# EAGLE design LocIT (EAGLE 9.6.2)
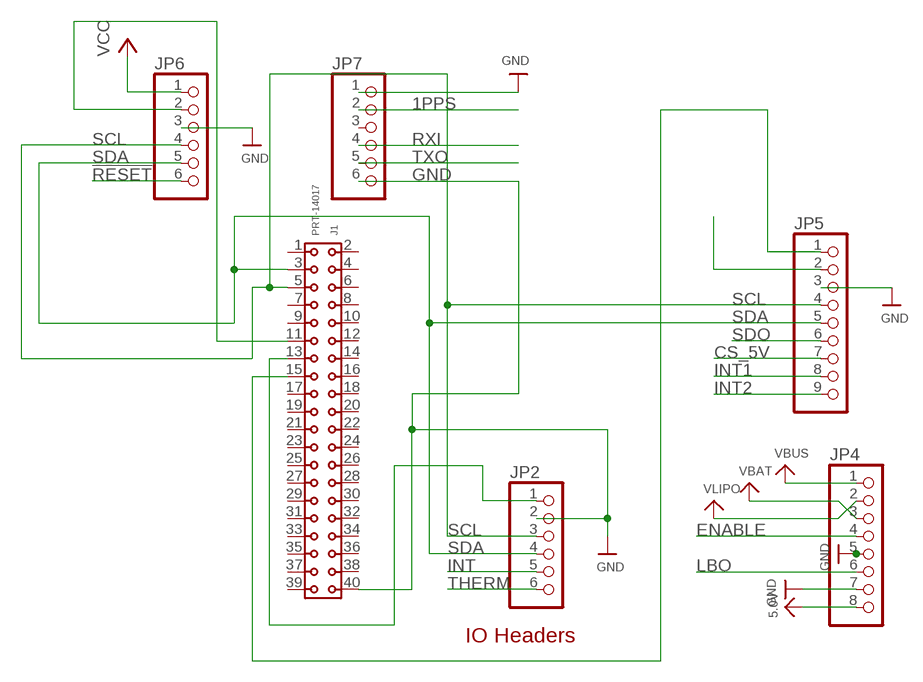
[diagram p0: schematic, sheet 1]

## Parts
J1  PRT-14017  [61304021821]
JP2  HEADER-1X670MIL  [1X06_ROUND_70]
JP4  HEADER-1X8ROUND  [1X08_ROUND]
JP5  HEADER-1X970MIL  [1X09_ROUND_70]
JP6  HEADER-1X670MIL  [1X06_ROUND_70]
JP7  HEADER-1X670MIL  [1X06_ROUND_70]

## Nets
1PPS: JP7.2
3.3V_GYRO [lowpower]: JP5.2
5.0V: JP4.8
!RESET: JP6.6
CS_5V: JP5.7
ENABLE: JP4.4
GND [highpower]: J1.40 JP2.2 JP4.5 JP4.7 JP5.3 JP6.3 JP7.1 JP7.6
INT: JP2.5
INT1: JP5.8
INT2: JP5.9
LBO: JP4.6
N$1 [lowpower]: J1.11 JP6.2
RXI: JP7.4
SCL: J1.5 JP2.3 JP5.4 JP6.4
SDA: J1.3 JP2.4 JP5.5 JP6.5
SDO: JP5.6
THERM: JP2.6
TXO: JP7.5
VBAT: JP4.3
VBUS: JP4.1
VCC [highpower]: JP6.1
VCC1 [lowpower]: J1.13 JP2.1
VCC_GYRO [highpower]: J1.15 JP5.1
VLIPO: JP4.2
Unconnected: J1.1 J1.2 J1.4 J1.6 J1.7 J1.8 J1.9 J1.10 J1.12 J1.14 J1.16 J1.17 J1.18 J1.19 J1.20 J1.21 J1.22 J1.23 J1.24 J1.25 J1.26 J1.27 J1.28 J1.29 J1.30 J1.31 J1.32 J1.33 J1.34 J1.35 J1.36 J1.37 J1.38 J1.39 JP7.3

## Notes on the sheet
- IO Headers

## Library data of the parts
J1 = PRT-14017:PRT-14017: WR-PHD 2.54 mm Dual Socket Header ARTICLE PROPERTIES: Pins:4;​ 6;​ 8;​ 10;​ 12;​ 14;​ 16;​ 18;​ 20;​ 22;​ 24;​ 26;​ 28;​ 30;​ 32;​ 34;​ 36;​ 40;​ 44;​ 64;​ 72 KIND PROPERTIES: Pitch：2.54 mm Quality Class:3 as per CECC 75 301-802 Rows：Dual Gender：Socket Header Type：Straight MATERIAL PROPERTIES: Insulator Material :PBT Insulator Flammability Rating:UL94 V-0 Contact Material:Copper Alloy Contact Plating:Gold Contact Type:Stamped GENERAL INFORMATION Operating Temperature:-40 up to +125 °C Compliance:Lead free / RoHS ELECTRICAL PROPERTIES: Rated Current:3 A IR 1:3 A Withstanding Voltage:500 V (AC) Contact Resistance:20 mΩ RISO:1000 MΩ CERTIFICATION UL Approval:E323964 PACKAGING PROPERTIES Packaging:Tray <https://katalog.we-online.com/media/images/v2/o57948v209%20Family_Dual_Socket_Header_WR-PHD_6130xx21821.jpg> Details see: https://katalog.we-online.com/en/em/PHD_2_54_DUAL_SOCKET_HEADER_6130XX21821 Updated by Yingchun,Shan 2019-10-21 2019 (C) Würth Elektronik Check availability <https://pricing.snapeda.com/parts/PRT-14017/SparkFun%20Electronics/view-part?ref=eda>; AVAILABILITY: In Stock; CHECK_PRICES: https://www.snapeda.com/parts/PRT-14017/SparkFun+Electronics/view-part/?ref=eda; DESCRIPTION: RASPBERRY PI GPIO TALL HEADER; MF: SparkFun Electronics; MP: PRT-14017; PACKAGE: None; PRICE: None; SNAPEDA_LINK: https://www.snapeda.com/parts/PRT-14017/SparkFun+Electronics/view-part/?ref=snap
JP2 JP6 JP7 = microbuilder:HEADER-1X6: PIN HEADER
JP4 = microbuilder:HEADER-1X8: PIN HEADER
JP5 = microbuilder:HEADER-1X9: PIN HEADER

## Net classes
1 highpower: width 0.406 mm, drill 0.483 mm
2 lowpower: width 0.305 mm, drill 0.483 mm

## Board
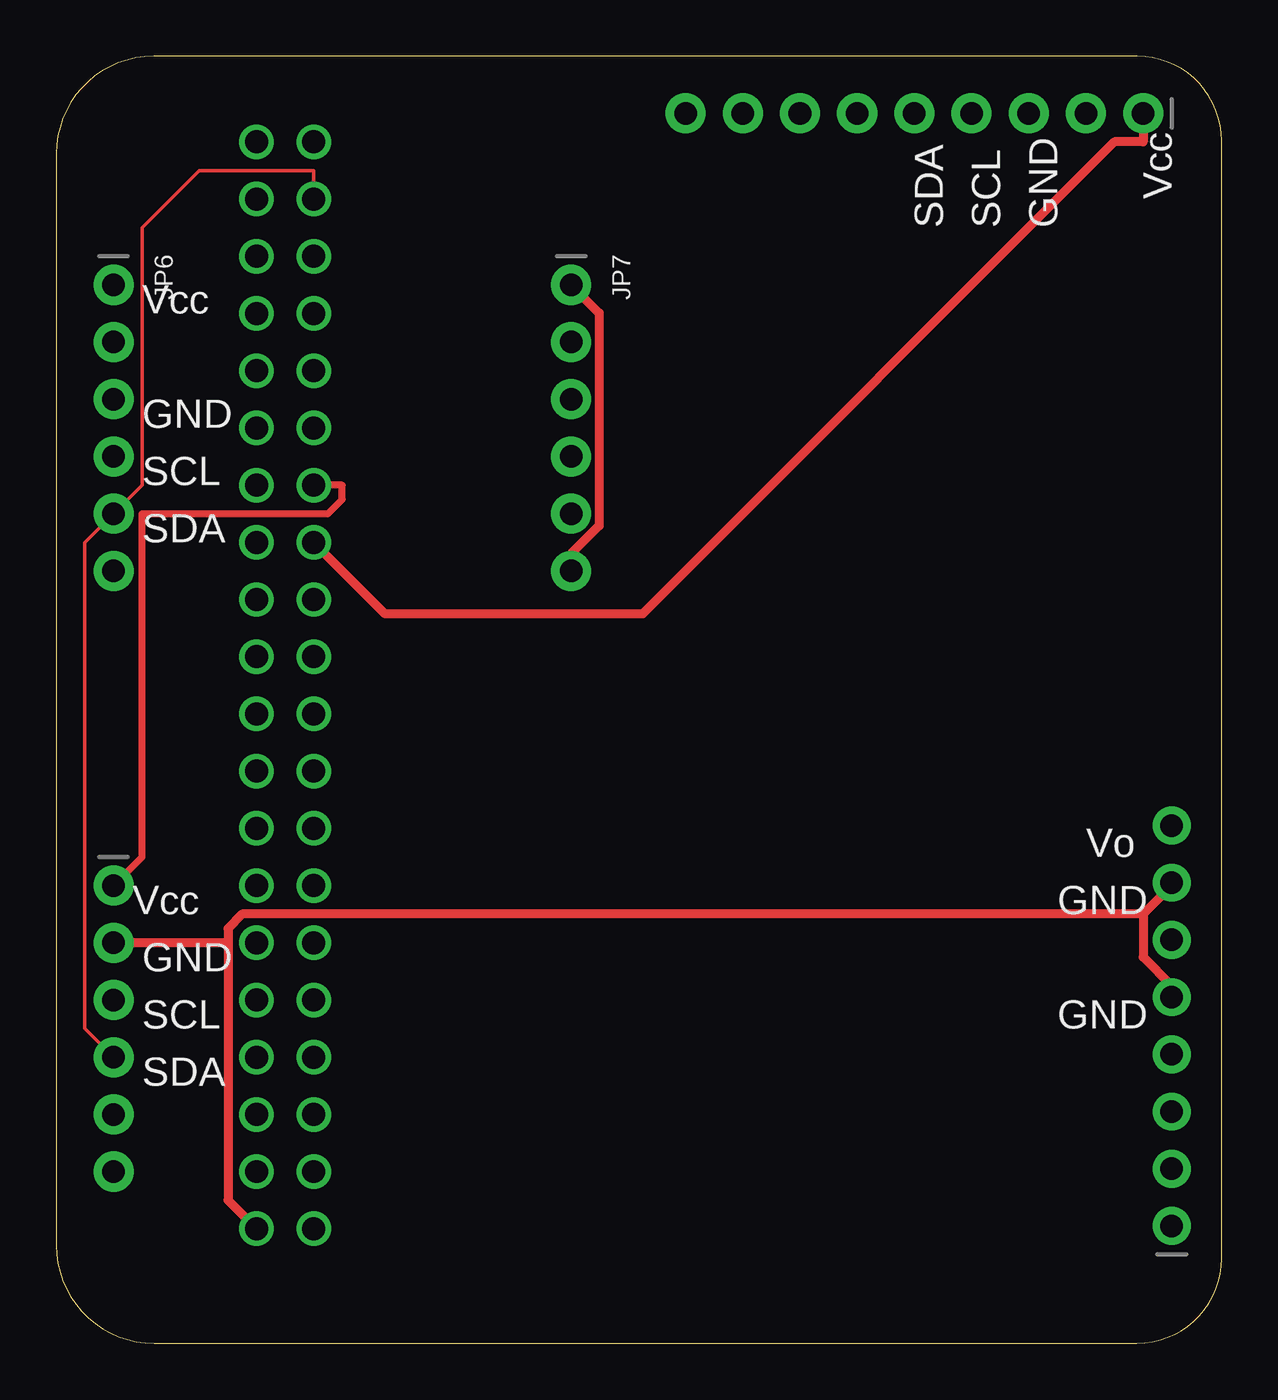
[diagram p1: board, top side]
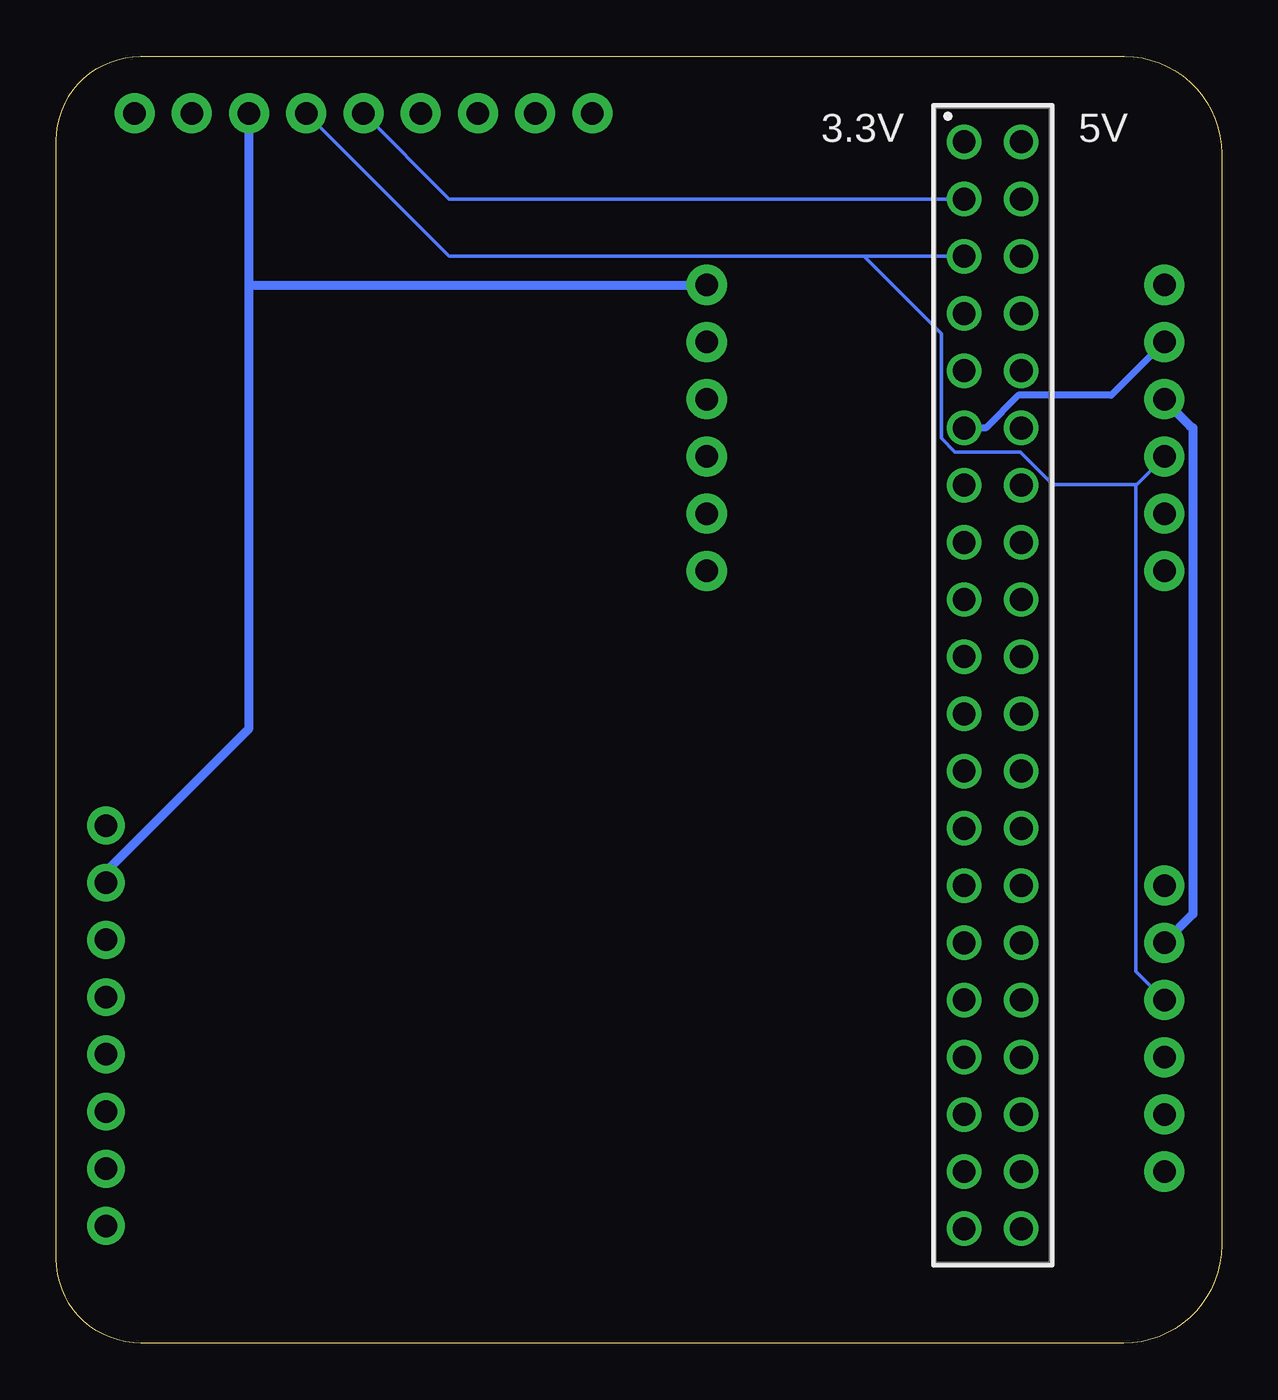
[diagram p2: board, bottom side, seen from below]

Size 51.74 x 57.14 mm. Coordinates in mm from the lower left corner, seen from the top.
Outline: 4.34,0 47.98,0 arc90 51.74,3.75 51.74,53.4 arc90 48,57.14 4.32,57.14 arc90 0,52.82 0,4.34 arc90 4.34,0
Copper layers (1*16): Top 0.035mm / dielectric 1.5mm / Bottom 0.035mm
Design rules "default": minimum track width 6mil, minimum drill 0.35mm, track to track 6mil, track to pad 6mil, pad to pad 6mil, via to via 6mil, smd to smd 6mil, copper to edge 40mil, drill to drill 6mil, minimum pad ring 10mil, minimum via ring 8mil, stop-mask expansion 4mil, vias tented up to drill 0mil, thermal gap 10mil

### Footprints (pad centres in the part's own frame; a part is rotated, then mirrored left to right if it is on the bottom)
61304021821 = drill 1.02: 1 -24.13,-1.27; 2 -24.13,1.27; 3 -21.59,-1.27; 4 -21.59,1.27; 5 -19.05,-1.27; 6 -19.05,1.27; 7 -16.51,-1.27; 8 -16.51,1.27; 9 -13.97,-1.27; 10 -13.97,1.27; 11 -11.43,-1.27; 12 -11.43,1.27; 13 -8.89,-1.27; 14 -8.89,1.27; 15 -6.35,-1.27; 16 -6.35,1.27; 17 -3.81,-1.27; 18 -3.81,1.27; 19 -1.27,-1.27; 20 -1.27,1.27; 21 1.27,-1.27; 22 1.27,1.27; 23 3.81,-1.27; 24 3.81,1.27; 25 6.35,-1.27; 26 6.35,1.27; 27 8.89,-1.27; 28 8.89,1.27; 29 11.43,-1.27; 30 11.43,1.27; 31 13.97,-1.27; 32 13.97,1.27; 33 16.51,-1.27; 34 16.51,1.27; 35 19.05,-1.27; 36 19.05,1.27; 37 21.59,-1.27; 38 21.59,1.27; 39 24.13,-1.27; 40 24.13,1.27
1X06_ROUND_70 = drill 1 pad 1.778: 1 -6.35,0; 2 -3.81,0; 3 -1.27,0; 4 1.27,0; 5 3.81,0; 6 6.35,0
1X08_ROUND = drill 1 pad 1.676: 1 -8.89,0; 2 -6.35,0; 3 -3.81,0; 4 -1.27,0; 5 1.27,0; 6 3.81,0; 7 6.35,0; 8 8.89,0
1X09_ROUND_70 = drill 1 pad 1.778: 1 -10.16,0; 2 -7.62,0; 3 -5.08,0; 4 -2.54,0; 5 0,0; 6 2.54,0; 7 5.08,0; 8 7.62,0; 9 10.16,0

### Placement (x,y rotation side)
J1  10.16,29.21 270 bottom
JP2  2.54,13.97 270 top
JP4  49.53,14.1 90 top
JP5  38.1,54.61 180 top
JP6  2.54,40.64 270 top
JP7  22.86,40.64 270 top

### Tracks (layer width: path | path; a pad name or v marks a point on that pad's centre or on a via)
GND
  Top 0.406: 48.26,19.05 48.26,17.15 49.53,15.88 JP4.5 | 48.26,19.05 49.53,20.32 JP4.7 | 7.62,17.78 JP2.2 | 7.62,17.78 7.62,18.41 8.25,19.05 48.26,19.05 | J1.40 7.62,6.35 7.62,17.78 | JP7.1 24.11,45.74 24.11,36.3 22.89,35.08 22.89,34.31 JP7.6
  Bottom 0.406: JP2.2 1.27,19.05 1.27,40.64 1.4,40.72 2.54,41.86 JP6.3 | 43.18,46.96 43.18,27.3 49.53,20.95 JP4.7 | 43.18,46.96 JP5.3 | 43.18,46.96 22.89,46.96 JP7.1
N$1
  Bottom 0.305: J1.11 10.46,40.64 9.02,42.09 4.9,42.09 JP6.2
SCL
  Bottom 0.152: JP2.3 3.81,16.51 3.81,38.1 | 15.87,48.26 34.29,48.26 JP5.4 | 15.87,48.26 J1.5 | 15.87,48.26 12.45,44.83 12.45,40.18 11.84,39.57 8.94,39.57 7.49,38.12 3.83,38.12 3.81,38.1 | JP6.4 2.54,39.34 3.76,38.12 3.81,38.1
SDA
  Top 0.152: JP2.4 1.27,13.97 1.27,35.56 JP6.5 3.81,38.1 3.81,49.53 6.35,52.07 11.43,52.07 J1.3
  Bottom 0.152: J1.3 34.29,50.8 JP5.5
VCC1
  Top 0.305: JP2.1 3.81,21.59 3.81,36.83 12.06,36.83 12.7,37.46 12.7,38.1 J1.13
VCC_GYRO
  Top 0.406: JP5.1 48.26,53.34 46.99,53.34 26.04,32.38 14.6,32.38 J1.15

### Text on the board
tPlace: Vcc | SDA | SCL | GND | Vcc | GND | SCL | SDA | Vo | Vcc | GND | GND | SCL | GND | SDA
bPlace: 5V | 3.3V